# Altium schematic sheet 原理图_V2.0.SchDoc
size A2; SheetNumber: 1; SheetTotal: 1
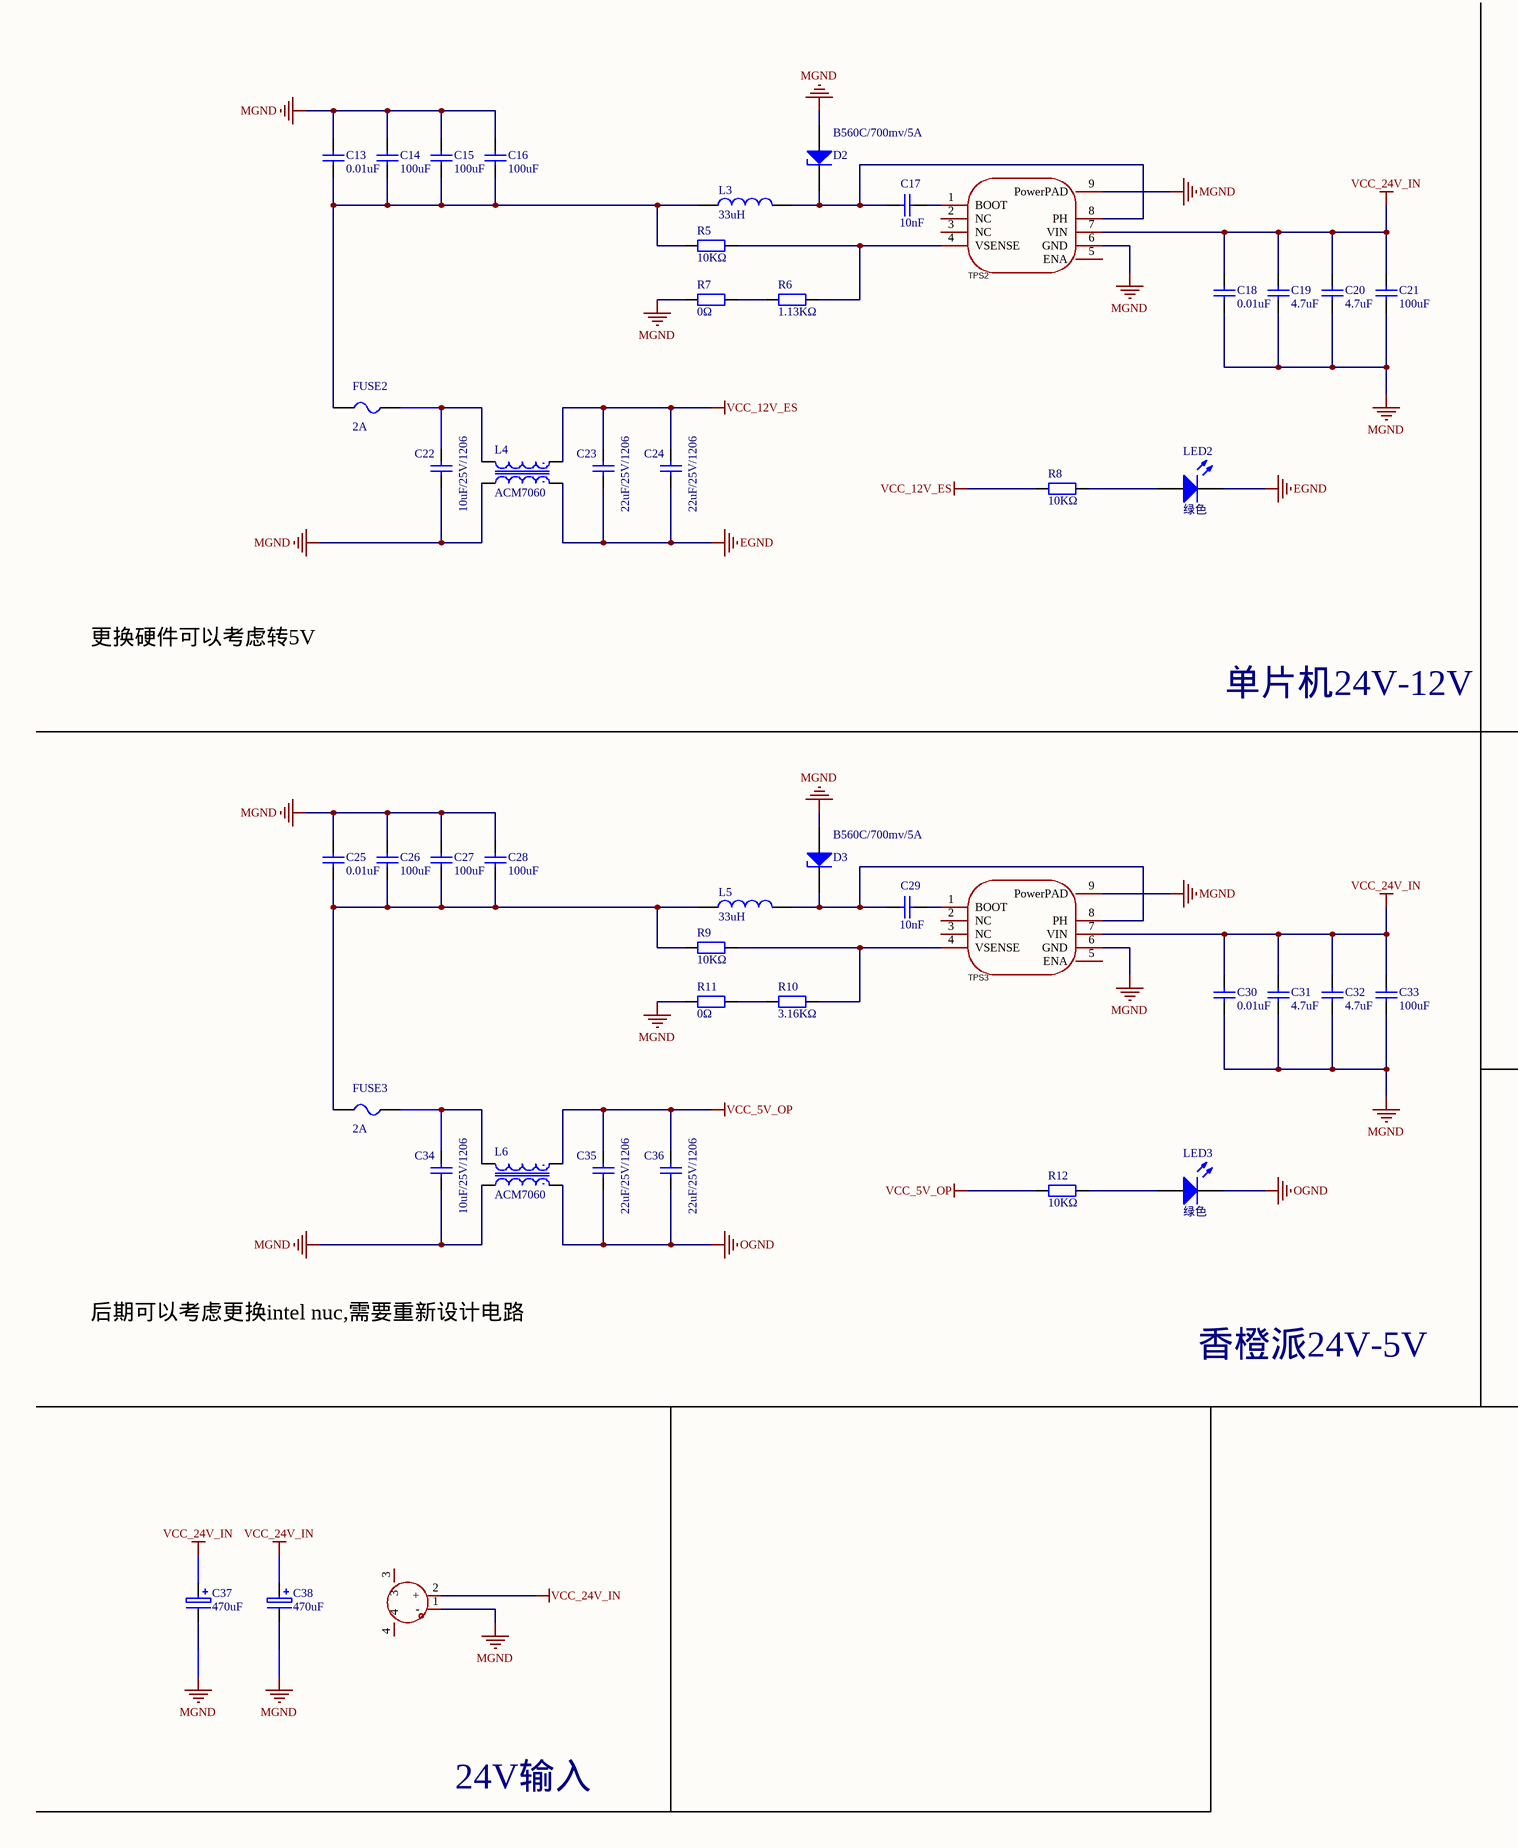
[diagram p0: 原理图_V2.0.SchDoc, left]
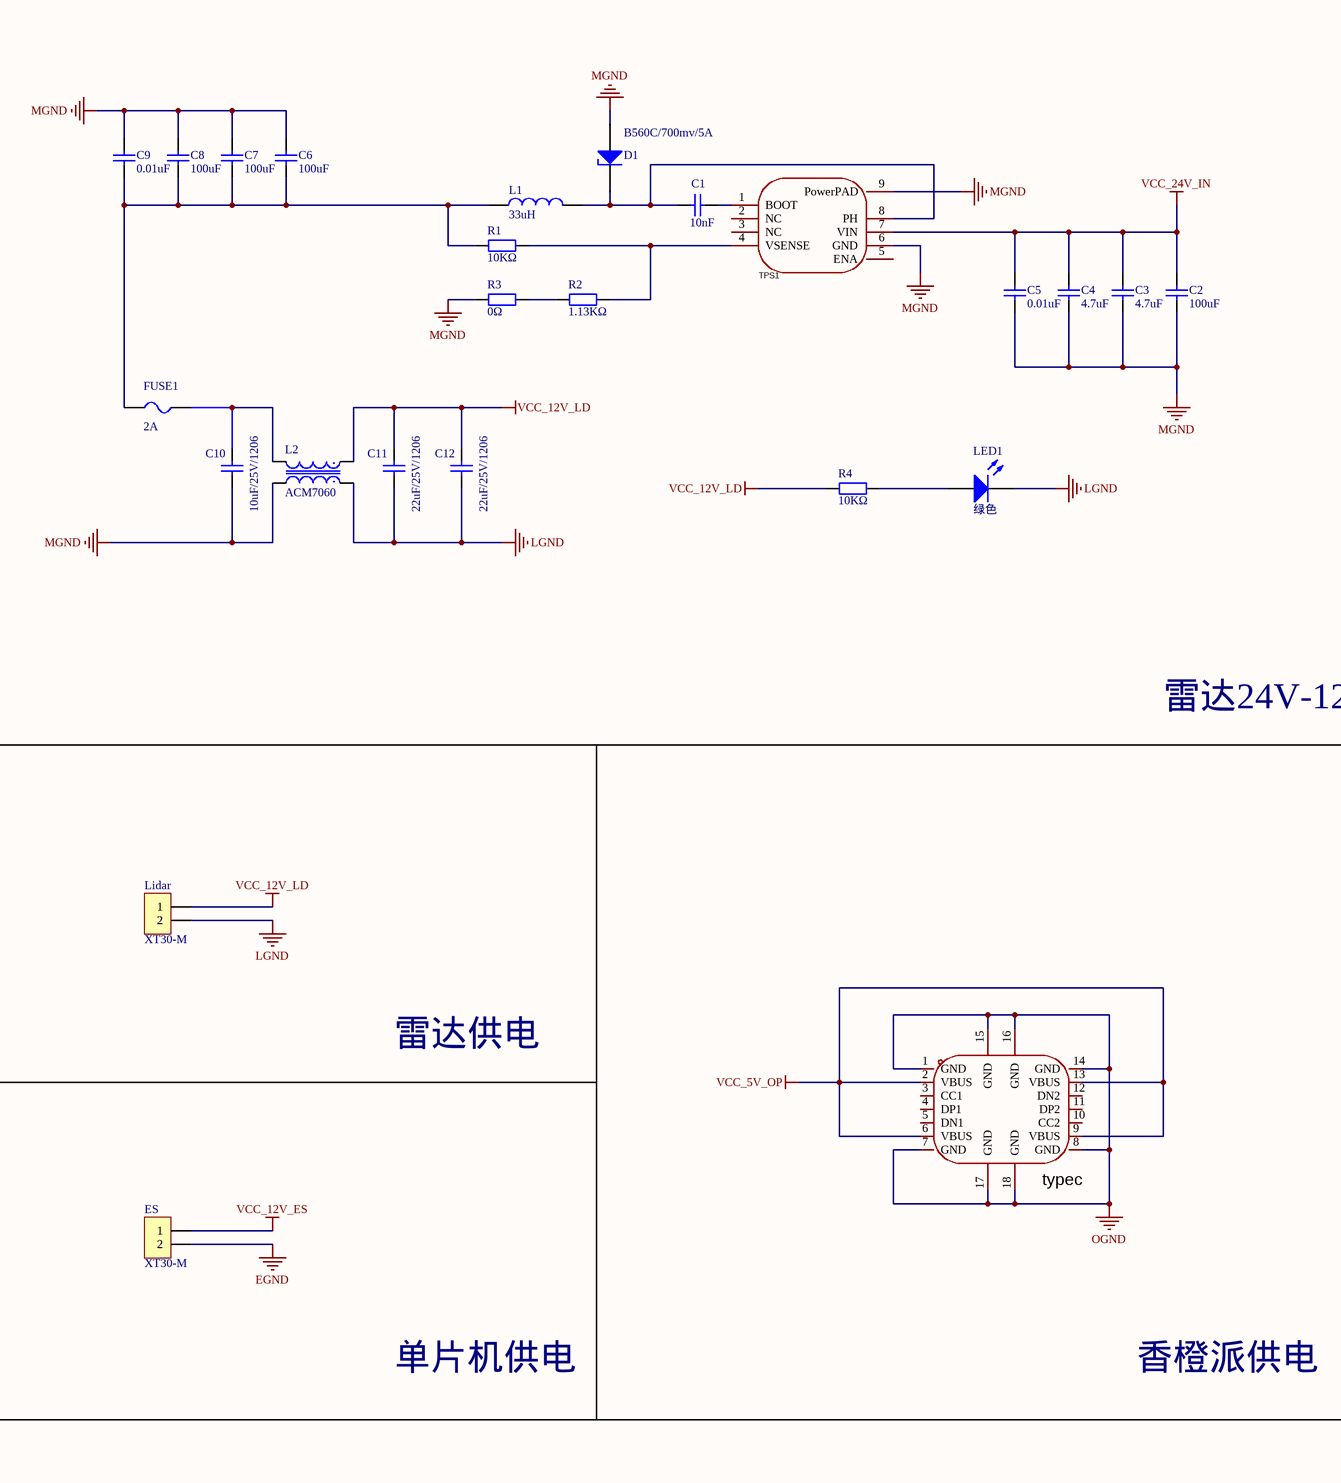
[diagram p1: 原理图_V2.0.SchDoc, right]

## Parts
C1  10nF  [C0603_L]
C2  100uF  [C1206_L]
C3  4.7uF  [C0603_L]
C4  4.7uF  [C0603_L]
C5  0.01uF  [C0603_L]
C6  100uF  [C1206_L]
C7  100uF  [C1206_L]
C8  100uF  [C1206_L]
C9  0.01uF  [C0603_L]
C10  10uF/25V/1206  [C1206_L]
C11  22uF/25V/1206  [C1206_L]
C12  22uF/25V/1206  [C1206_L]
C13  0.01uF  [C0603_L]
C14  100uF  [C1206_L]
C15  100uF  [C1206_L]
C16  100uF  [C1206_L]
C17  10nF  [C0603_L]
C18  0.01uF  [C0603_L]
C19  4.7uF  [C0603_L]
C20  4.7uF  [C0603_L]
C21  100uF  [C1206_L]
C22  10uF/25V/1206  [C1206_L]
C23  22uF/25V/1206  [C1206_L]
C24  22uF/25V/1206  [C1206_L]
C25  0.01uF  [C0603_L]
C26  100uF  [C1206_L]
C27  100uF  [C1206_L]
C28  100uF  [C1206_L]
C29  10nF  [C0603_L]
C30  0.01uF  [C0603_L]
C31  4.7uF  [C0603_L]
C32  4.7uF  [C0603_L]
C33  100uF  [C1206_L]
C34  10uF/25V/1206  [C1206_L]
C35  22uF/25V/1206  [C1206_L]
C36  22uF/25V/1206  [C1206_L]
C37  470uF  [CT 5.0*10*13 - V]
C38  470uF  [CT 5.0*10*13 - R]
CN?  XT60PW-M  [XT60PW-M2]  (value not drawn)
D1  B560C/700mv/5A  [SMC]
D2  B560C/700mv/5A  [SMC]
D3  B560C/700mv/5A  [SMC]
ES  XT30-M  [XT30PW-M]
FUSE1  2A  [F1206]
FUSE2  2A  [F1206]
FUSE3  2A  [F1206]
L1  33uH  [SMD_L13.8-W12.6]
L2  ACM7060  [L-SMD]
L3  33uH  [SMD_L7.0-W6.6]
L4  ACM7060  [L-SMD]
L5  33uH  [SMD_L13.8-W12.6]
L6  ACM7060  [L-SMD]
LED1  绿色  [LED0603_G]
LED2  绿色  [LED0603_G]
LED3  绿色  [LED0603_G]
Lidar  XT30-M  [XT30PW-M]
R1  10KΩ  [R0603_L]
R2  1.13KΩ  [R0603_L]
R3  0Ω  [R0603_L]
R4  10KΩ  [R0603_L]
R5  10KΩ  [R0603_L]
R6  1.13KΩ  [R0603_L]
R7  0Ω  [R0603_L]
R8  10KΩ  [R0603_L]
R9  10KΩ  [R0603_L]
R10  3.16KΩ  [R0603_L]
R11  0Ω  [R0603_L]
R12  10KΩ  [R0603_L]
TPS1  TPS5430DDAR  [ESOP-8_L4.9-W3.9-P1.27-LS6.0-TL-EP]  (value not drawn)
TPS2  TPS5430DDAR  [ESOP-8_L4.9-W3.9-P1.27-LS6.0-TL-EP]  (value not drawn)
TPS3  TPS5430DDAR  [ESOP-8_L4.9-W3.9-P1.27-LS6.0-TL-EP]  (value not drawn)
typec  U264-141N-4BAC10  [USB-C-Type-侧插]  (value not drawn)

## Nets
EGND: C23.1 C24.1 ES.2 L4.2 LED2.2(K)
LGND: C11.1 C12.1 L2.2 LED1.2(K) Lidar.2
MGND: C2.1 C3.1 C4.1 C5.1 C6.2 C7.2 C8.2 C9.2 C10.1 C13.2 C14.2 C15.2 C16.2 C18.1 C19.1 C20.1 C21.1 C22.1 C25.2 C26.2 C27.2 C28.2 C30.1 C31.1 C32.1 C33.1 C34.1 C37.2 C38.2 CN?.1(-) D1.1(A) D2.1(A) D3.1(A) L2.3 L4.3 L6.3 R3.2 R7.2 R11.2 TPS1.6(GND) TPS1.9(PowerPAD) TPS2.6(GND) TPS2.9(PowerPAD) TPS3.6(GND) TPS3.9(PowerPAD)
OGND: C35.1 C36.1 L6.2 LED3.2(K) typec.1(GND) typec.7(GND) typec.8(GND) typec.14(GND) typec.15(GND) typec.16(GND) typec.17(GND) typec.18(GND)
VCC_5V_OP: C35.2 C36.2 L6.1 R12.1 typec.2(VBUS) typec.6(VBUS) typec.9(VBUS) typec.13(VBUS)
VCC_12V_ES: C23.2 C24.2 ES.1 L4.1 R8.1
VCC_12V_LD: C11.2 C12.2 L2.1 Lidar.1 R4.1
VCC_24V_IN: C2.2 C3.2 C4.2 C5.2 C18.2 C19.2 C20.2 C21.2 C30.2 C31.2 C32.2 C33.2 C37.1 C38.1 CN?.2(+) TPS1.7(VIN) TPS2.7(VIN) TPS3.7(VIN)
NetC1_1: C1.1 D1.2(K) L1.2 TPS1.8(PH)
NetC1_2: C1.2 TPS1.1(BOOT)
NetC6_1: C6.1 C7.1 C8.1 C9.1 FUSE1.2 L1.1 R1.2
NetC10_2: C10.2 FUSE1.1 L2.4
NetC13_1: C13.1 C14.1 C15.1 C16.1 FUSE2.2 L3.1 R5.2
NetC17_1: C17.1 D2.2(K) L3.2 TPS2.8(PH)
NetC17_2: C17.2 TPS2.1(BOOT)
NetC22_2: C22.2 FUSE2.1 L4.4
NetC25_1: C25.1 C26.1 C27.1 C28.1 FUSE3.2 L5.1 R9.2
NetC29_1: C29.1 D3.2(K) L5.2 TPS3.8(PH)
NetC29_2: C29.2 TPS3.1(BOOT)
NetC34_2: C34.2 FUSE3.1 L6.4
NetLED1_1: LED1.1(A) R4.2
NetLED2_1: LED2.1(A) R8.2
NetLED3_1: LED3.1(A) R12.2
NetR1_1: R1.1 R2.1 TPS1.4(VSENSE)
NetR2_2: R2.2 R3.1
NetR5_1: R5.1 R6.1 TPS2.4(VSENSE)
NetR6_2: R6.2 R7.1
NetR9_1: R9.1 R10.1 TPS3.4(VSENSE)
NetR10_2: R10.2 R11.1

Not connected (* = marked no-connect by the designer): CN? 3 4; TPS1 2(NC) 3(NC) 5(ENA); TPS2 2(NC) 3(NC) 5(ENA); TPS3 2(NC) 3(NC) 5(ENA); typec 3(CC1) 4(DP1) 5(DN1) 10(CC2) 11(DP2) 12(DN2)

## Notes on the sheet
- 更换硬件可以考虑转5V
- 单片机24V-12V
- 雷达24V-12V
- 雷达供电
- 后期可以考虑更换intel nuc,需要重新设计电路
- 香橙派24V-5V
- 单片机供电
- 香橙派供电
- 24V输入

## Library data of the parts
C1-C36 = C: 贴片电容/MLCC电容; BOM名称: 无极性贴片电容; 联系下单店铺卖家 免费帮你查找封装: 联系下单店铺卖家 免费技术指导
C37 C38 = cap_polarity: Electrolytic Capacitor
CN? = XT60PW-M: Manufacturer: AMASS(艾迈斯); Add into BOM: yes; Brand: 艾迈斯; InterfaceType: 公头; Symbol: XT60PW-M; Device: XT60PW-M; LCSC Part Name: AMASS(艾迈斯)航模插头xt60连接器150公母对接pw锂电池公头 板插卧式XT60PW-M; Supplier Part: C98732; Manufacturer Part: XT60PW-M; Supplier Footprint: -; JLCPCB Part Class: Extended Part; Datasheet: https://atta.szlcsc.com/upload/public/pdf/source/20240118/44A3DCFF53BE25DC65378AFFB21277A4.pdf; Supplier: LCSC; Convert to PCB: yes; Model: XT60PW-M; Power: -; Output: -; Input: -; Size: -; Interface: -; Type: 卧式插头; Colour: 黄色; MaximumCurrent: -; RatedVoltage: -; Type1: -; NumberOfUSBHoles: -; MetalMaterial: -; InsulationMaterial: -; RatedCurrent: -; RecommendedWireGauge: -; FlameRetardantGrade: -; contact resistance: -; Belt length: -; specifications: -
D1-D3 = 稳压二极管: Zener Diode; 当前库版本V2024.8.30，下一版本发布时间2024年10月份 @淘宝卖家:黄晶宝石: 最新版本发布网址https://item.taobao.com/item.htm?id=566775463719
ES Lidar = XT30-M: XT30公头; 当前库版本V2024.5.31，下一版本发布时间2024年8月份 @淘宝卖家:黄晶宝石: 最新版本发布网址https://item.taobao.com/item.htm?id=566775463719
FUSE1-FUSE3 = FUSE 1808: 1808保险座; 当前库版本V2024.8.30，下一版本发布时间2024年10月份 @淘宝卖家:黄晶宝石: 最新版本发布网址https://item.taobao.com/item.htm?id=566775463719; BOM名称: 1808保险座
L1 L3 L5 = L: 贴片小功率电感; BOM名称: 小功率贴片电感; 联系下单店铺卖家 免费帮你查找封装: 联系下单店铺卖家 免费技术指导
L2 L4 L6 = ACM7060: 共模电感
LED1-LED3 = LED: 贴片LED; 封装库来自淘宝卖家：黄晶宝石: 其他店铺购入均为盗版封装库，无更新权益，请立即申请退款，本店现金奖励200~1000元; BOM名称: 贴片LED
R1-R12 = R: 贴片电阻; 联系下单店铺卖家 免费帮你查找封装: 联系下单店铺卖家 免费技术指导; BOM名称: 贴片电阻
TPS1-TPS3 = TPS5430DDAR: Manufacturer: TI(德州仪器); Add into BOM: yes; Function: 降压型; Output Type: 可调; Input Voltage: 5.5V~36V; Output Voltage: 1.221V~32.04V; Output Current (Max): 3A; Switching Frequency: 500kHz; Synchronous Rectification: 否; Number of Outputs: 1; Topology: 降压式; Switch tube (built-in/external): 内置; Symbol: TPS5430DDAR; Device: TPS5430DDAR; LCSC Part Name: 降压 3A 36V; Supplier Part: C9864; Manufacturer Part: TPS5430DDAR; Supplier Footprint: SOIC-8-EP; JLCPCB Part Class: Basic Part; Datasheet: https://www.ti.com/cn/lit/gpn/tps5430; Supplier: LCSC; Convert to PCB: yes; Operating Temperature: -40℃~+125℃@(TJ)
typec = USB3.0-type-c-侧插: Manufacturer: XKB Connectivity(中国星坤); Add into BOM: yes; Connector Type: Type-C; Gender: 母; Number of Ports: 1; Number of Contacts: 14P; Current Rating - Power (Max): 3A; Soldering Temperature(Max): 235℃; Symbol: U264-141N-4BAC10; Device: U264-141N-4BAC10; LCSC Part Name: Type-C 母 侧插; Supplier Part: C692526; Manufacturer Part: U264-141N-4BAC10; Supplier Footprint: 插件; JLCPCB Part Class: Extended Part; Datasheet: https://atta.szlcsc.com/upload/public/pdf/source/20211011/3C526B1D157DB714A375BD92771BEA39.pdf; Supplier: LCSC; Convert to PCB: yes; Standard: USB 3.1; Mounting Style: 侧插; Contact Material: 铜合金; Contact Plating: 金; Operating Temperature Range: -40℃~+85℃